# Altium schematic sheet 05-mcu3.SchDoc: MCU
size Letter; DrawnBy: J. Brinton; Engineer: J. Brinton; Revision: 1; SheetNumber: 5; SheetTotal: 14
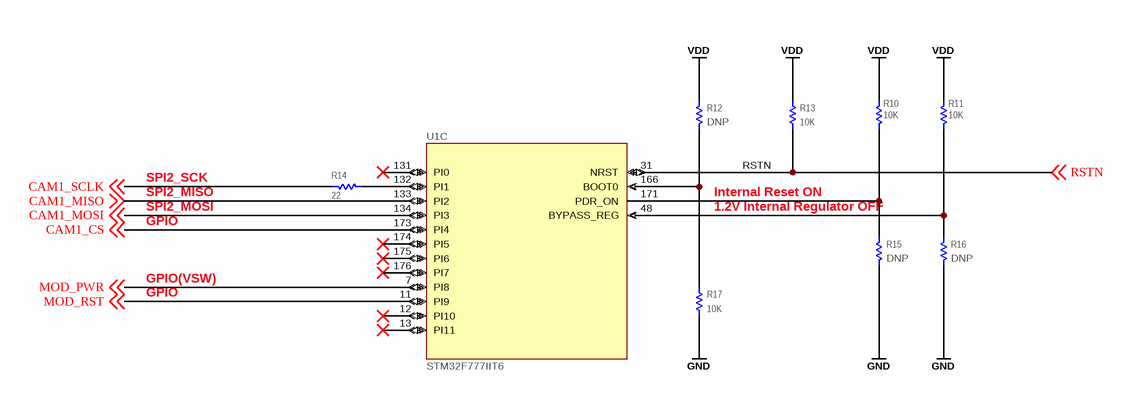
[diagram p0: 05-mcu3.SchDoc]

## Parts
R10  value 10K  [RESC2012X70N]  (hidden comment: ERJ-6ENF1002V)
R11  value 10K  [RESC2012X70N]  (hidden comment: ERJ-6ENF1002V)
R12  Do Not Place: DNP  [RESC2012X70N]  (hidden comment: ERJ-6ENF1002V)
R13  value 10K  [RESC2012X70N]  (hidden comment: ERJ-6ENF1002V)
R14  value 22  [RESC2012X70N]  (hidden comment: ERJ-6ENF22R0V)
R15  Do Not Place: DNP  [RESC2012X70N]  (hidden comment: ERJ-6ENF1002V)
R16  Do Not Place: DNP  [RESC2012X70N]  (hidden comment: ERJ-6ENF1002V)
R17  value 10K  [RESC2012X70N]  (hidden comment: ERJ-6ENF1002V)
U1  STM32F777IIT6  [TSQFP50P2600X2600X160-176N]  (part C of 4)

## Nets
GND: R15.1 R16.1 R17.1
VDD: R10.2 R11.2 R12.2 R13.2
CAM1_CS: U1.173(PI4) ; off-sheet CAM1_CS
CAM1_MISO: U1.133(PI2) ; off-sheet CAM1_MISO
CAM1_MOSI: U1.134(PI3) ; off-sheet CAM1_MOSI
CAM1_SCLK: R14.1 ; off-sheet CAM1_SCLK
MOD_PWR: U1.7(PI8) ; off-sheet MOD_PWR
MOD_RST: U1.11(PI9) ; off-sheet MOD_RST
RSTN: R13.1 U1.31(NRST) ; off-sheet RSTN
NetR10_1: R10.1 R15.2 U1.171(PDR_ON)
NetR11_1: R11.1 R16.2 U1.48(BYPASS_REG)
NetR12_1: R12.1 R17.2 U1.166(BOOT0)
NetR14_2: R14.2 U1.132(PI1)

Not connected (* = marked no-connect by the designer): U1 12(PI10)* 13(PI11)* 131(PI0)* 174(PI5)* 175(PI6)* 176(PI7)*

## Notes on the sheet
- SPI2_MISO
- SPI2_MOSI
- SPI2_SCK
- GPIO
- (near R15) 1.2V Internal Regulator OFF
- Internal Reset ON
- GPIO(VSW)
- Designed By:
- Title
- Engineer
- Revision
- Drawn By
- Date
- Sheet
- of

## Library data of the parts
R10-R13 R15-R17 = RES 0402: Thick Film Resistor 10k ±1% 0805; Manufacturer: Panasonic; Tr: -55:155; Package: 0805; Manufacturer P/N: ERJ-6ENF1002V; Tolerance: ±1%
  R12 R15 R16: Value: 10K
R14 = RES 0402: Thick Film Resistor 22 ±1% 0805; Manufacturer: Panasonic; Tr: -55:155; Package: 0805; Manufacturer P/N: ERJ-6ENF22R0V; Tolerance: ±1%
U1 = STM32F777IIT: Microcontroller; Manufacturer: STMicroelectronics; Manufacturer P/N: STM32F777IIT6